# Altium schematic sheet Sheet4 - Capteurs.SchDoc
size A4; DocumentNumber: 1; SheetNumber: 4
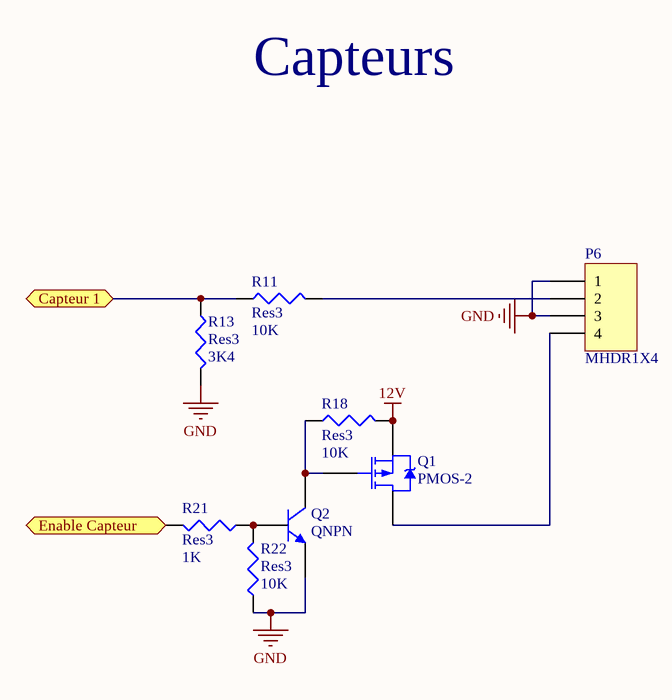
[diagram p0: Sheet4 - Capteurs.SchDoc]

## Parts
P6  MHDR1X4  [MHDR1X4]
Q1  PMOS-2  [SFM-T3/A4.7V]
Q2  QNPN  [SOT95P240-3N]
R11  Res3  value 10K  [RESC1608L]
R13  Res3  value 3K4  [RESC1608L]
R18  Res3  value 10K  [RESC1608L]
R21  Res3  value 1K  [RESC1608L]
R22  Res3  value 10K  [RESC1608L]

## Ports
Capteur 1, Enable Capteur (bidir)

## Nets
12V: Q1.3(S) R18.2
GND: P6.1 P6.3 Q2.3(E) R13.2 R22.1
Capteur 1: R11.1 R13.1 ; port Capteur 1
Enable Capteur: R21.2 ; port Enable Capteur
NetP6_2: P6.2 R11.2
NetP6_4: P6.4 Q1.2(D)
NetQ1_1: Q1.1(G) Q2.1(C) R18.1
NetQ2_2: Q2.2(B) R21.1 R22.2

## Notes on the sheet
- Capteurs

## Library data of the parts
P6 = MHDR1X4: Header, 4-Pin; LatestRevisionDate: 17-Jul-2002; LatestRevisionNote: Re-released for DXP Platform.; Publisher: Altium Limited
Q1 = PMOS-2: P-Channel Power MOSFET; Note: Pin 4 not drawn and electrically connected to Pin 2.; Published: 8-Jun-2000; LatestRevisionDate: 17-Jul-2002; LatestRevisionNote: Re-released for DXP Platform.; DatasheetVersion: PD-9.390D; PackageReference: TO-220AB; Publisher: Altium Limited; Code_JEDEC: TO-220-AB; ComponentLink1Description: Manufacturer Link; ComponentLink1URL: http://www.irf.com/
Q2 = QNPN: NPN Bipolar Transistor; Published: 8-Jun-2000; LatestRevisionDate: 29-May-2009; LatestRevisionNote: IPC-7351 Footprint Added.; PackageVersion: Aug-1999; PackageReference: SOT-23B; Publisher: Altium Limited; PackageDescription: 3-Pin SOT-23 Package 0.95 mm Pitch, 2.4 mm Lead Span
R11 R13 R18 R21 R22 = Res3: Resistor; Published: 8-Jun-2000; LatestRevisionDate: 29-May-2009; LatestRevisionNote: IPC-7351 Footprint Added.; PackageReference: J1-0603; Publisher: Altium Limited; PackageDescription: Chip Resistor